# EAGLE design EtchController (EAGLE 9.4.2)
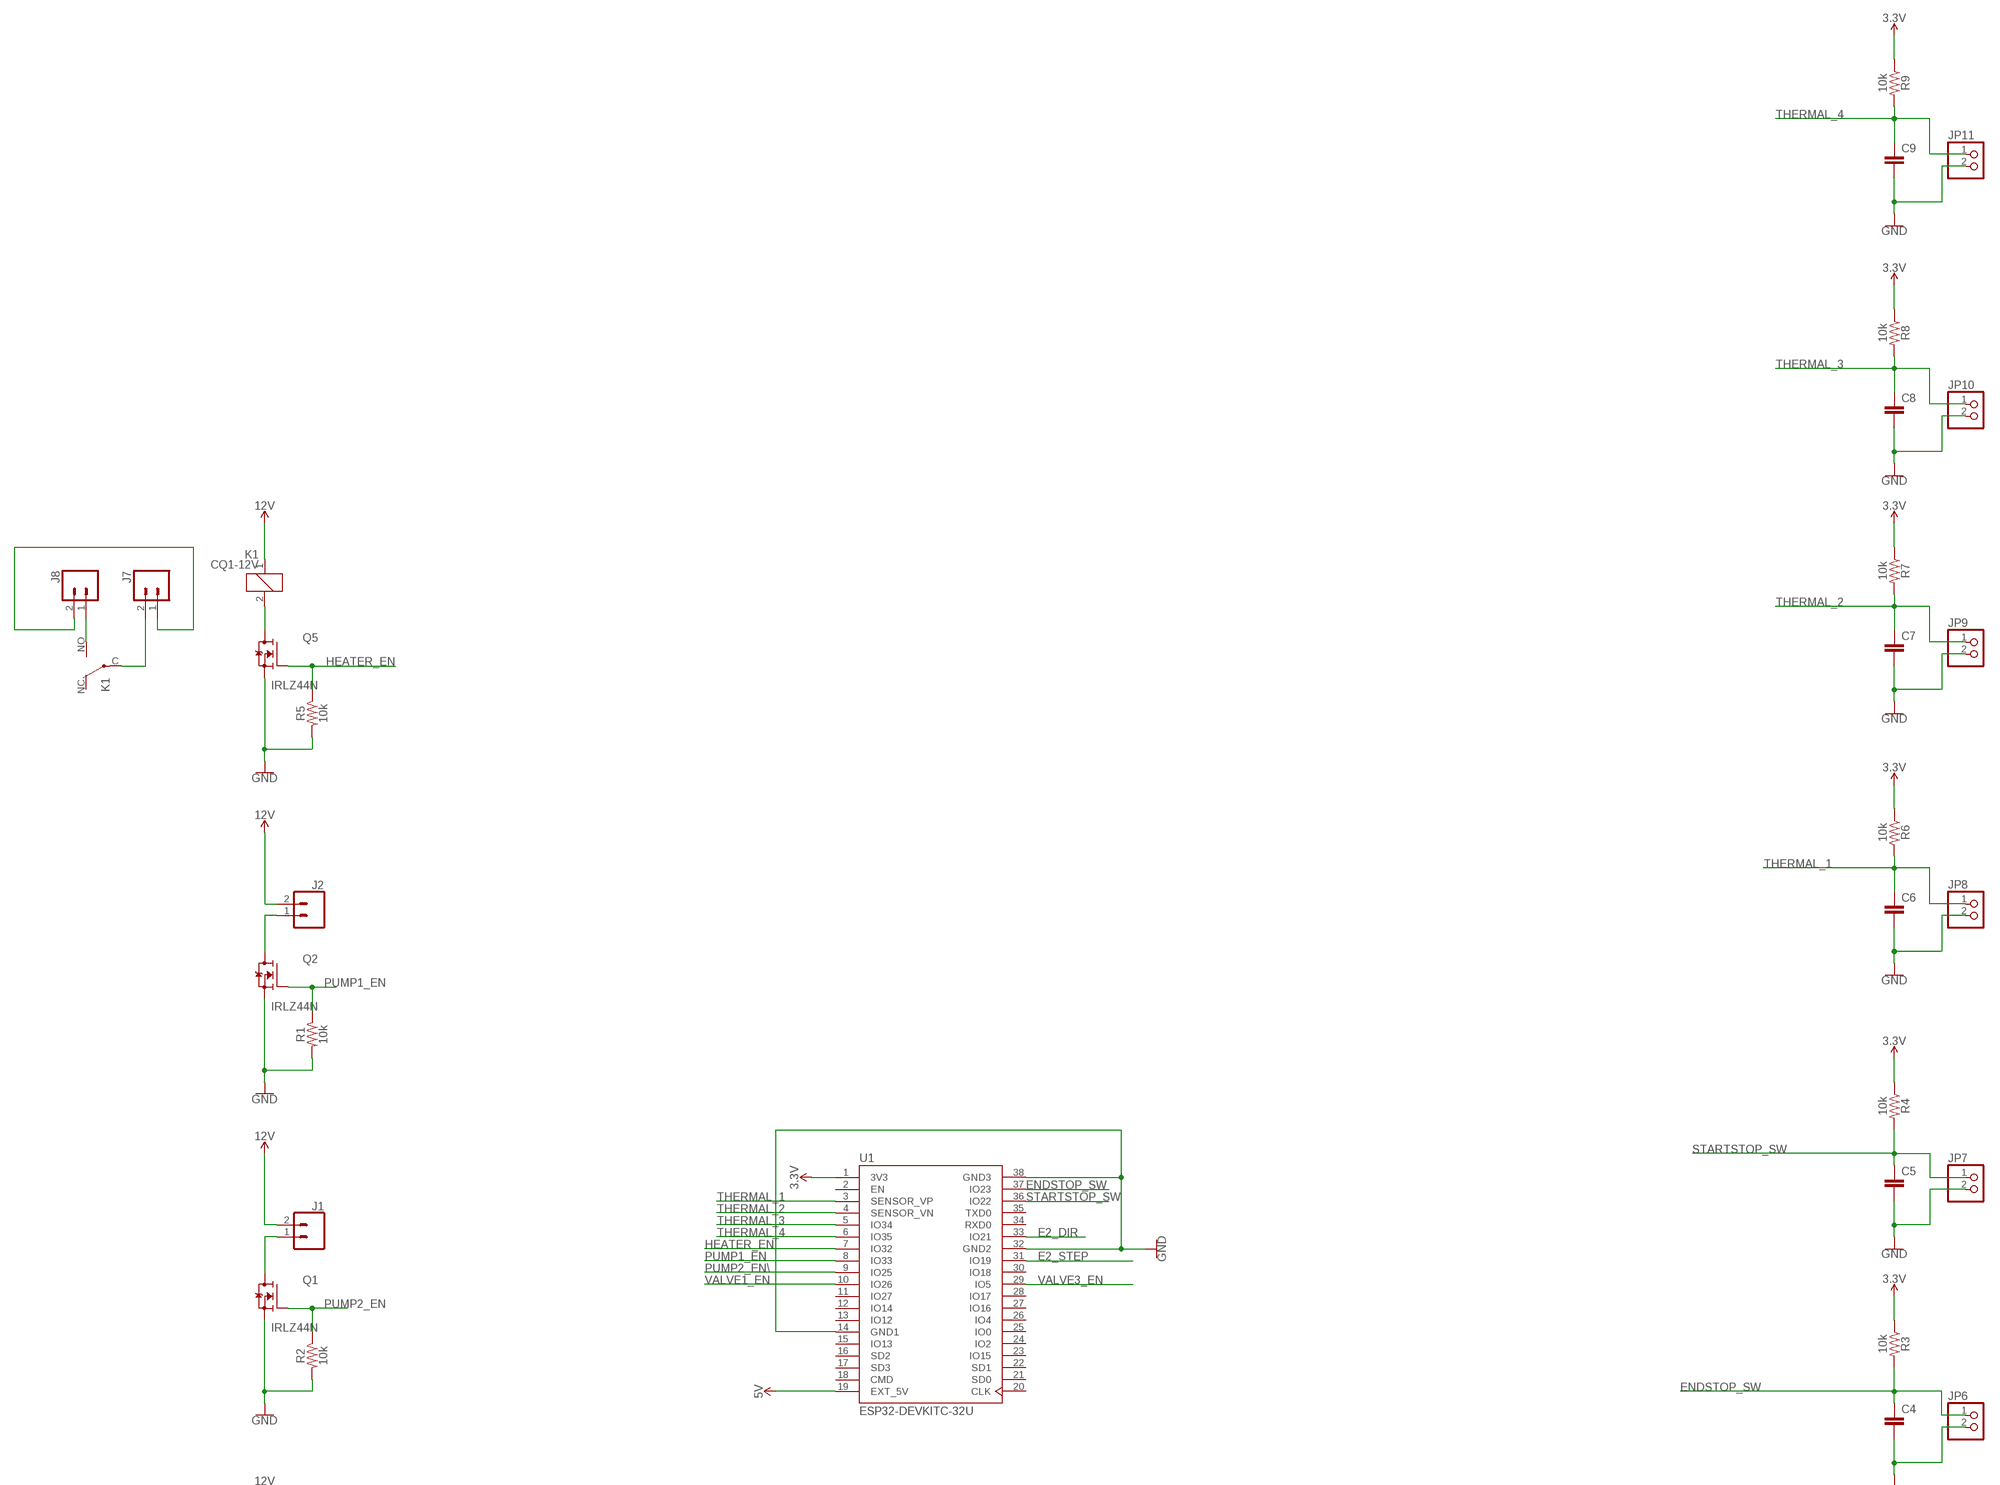
[diagram p0: schematic, sheet 1, part 1 of 2]
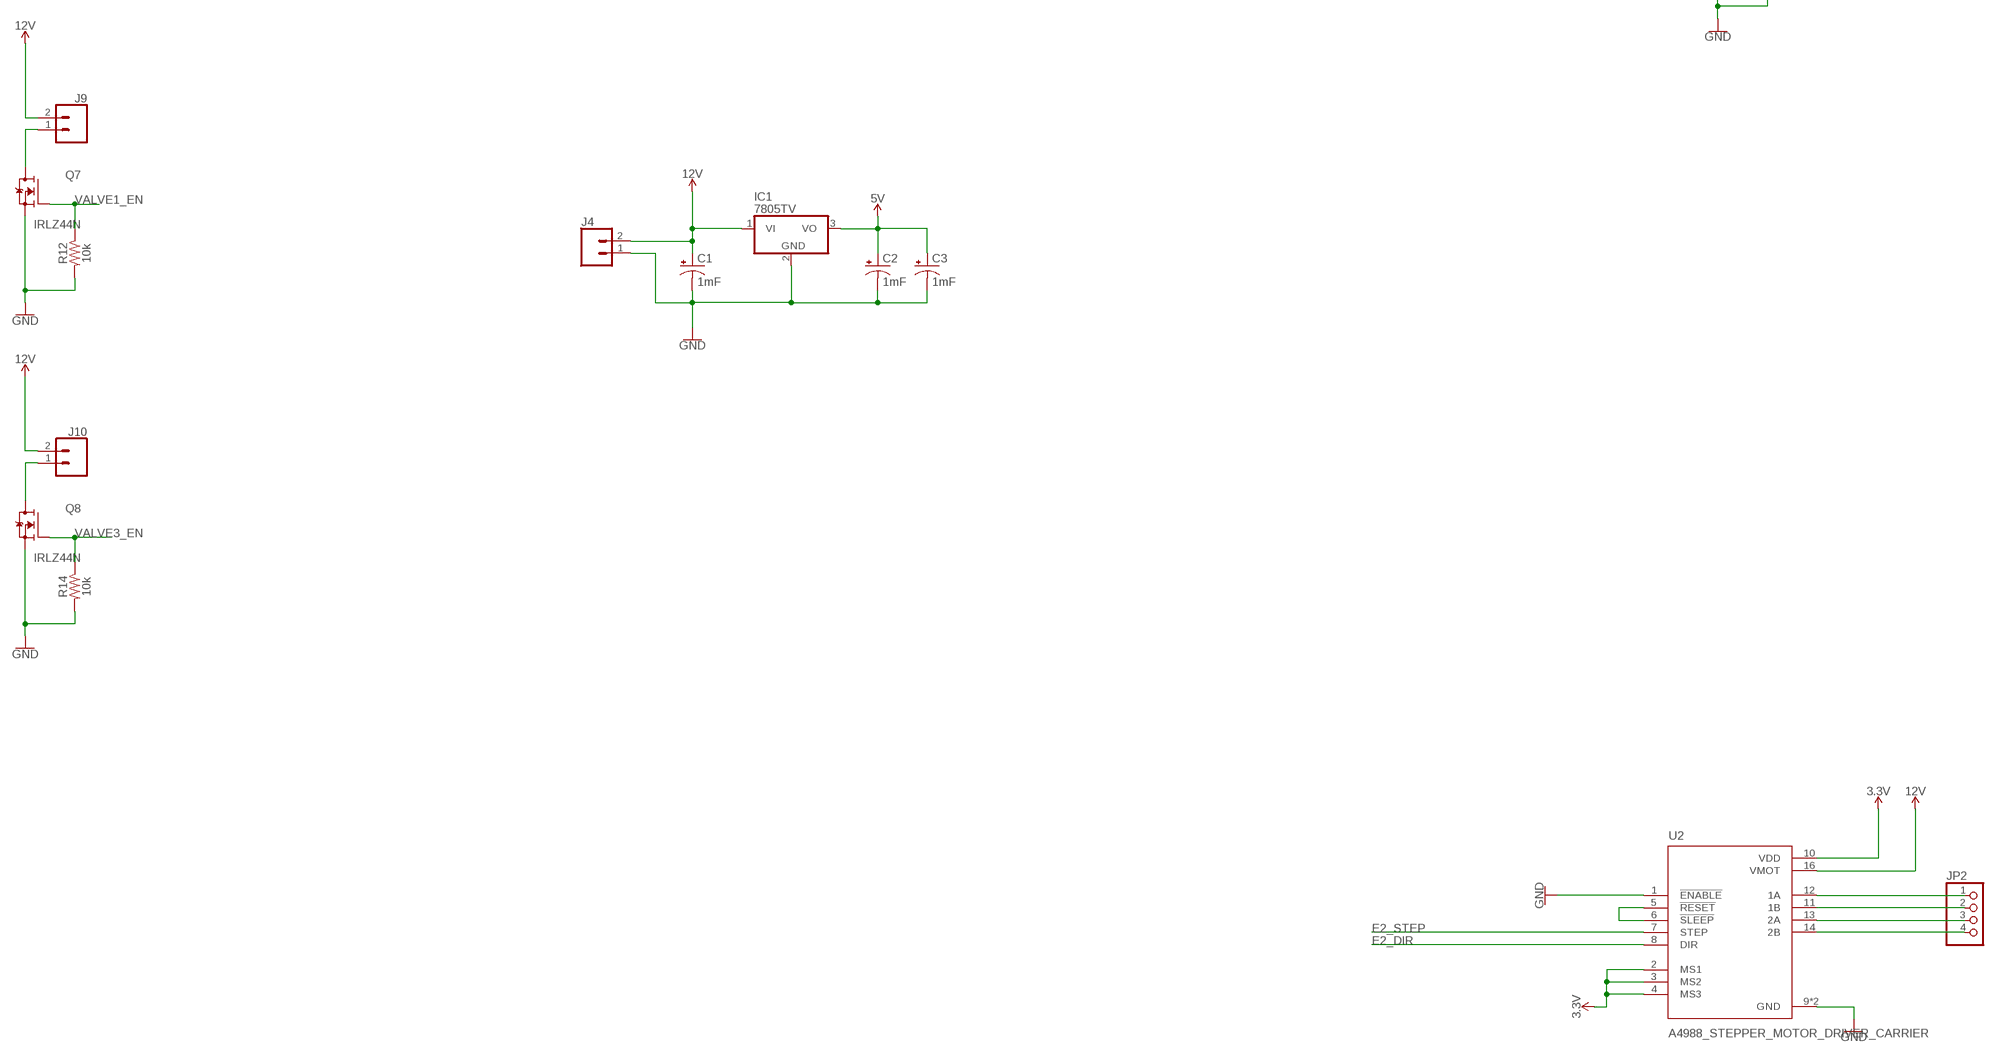
[diagram p1: schematic, sheet 1, part 2 of 2]

## Parts
C1  1mF  1000UF-RADIAL-5MM-25V-20%  [CPOL-RADIAL-5MM-10MM]
C2  1mF  1000UF-RADIAL-5MM-25V-20%  [CPOL-RADIAL-5MM-10MM]
C3  1mF  1000UF-RADIAL-5MM-25V-20%  [CPOL-RADIAL-5MM-10MM]
C4  C2,5-3  [C2.5-3]
C5  C2,5-3  [C2.5-3]
C6  C2,5-3  [C2.5-3]
C7  C2,5-3  [C2.5-3]
C8  C2,5-3  [C2.5-3]
C9  C2,5-3  [C2.5-3]
IC1  7805TV  [TO220V]
J1  CONN_023.5MM  [SCREWTERMINAL-3.5MM-2]
J2  CONN_023.5MM  [SCREWTERMINAL-3.5MM-2]
J4  CONN_023.5MM-NO_SILK  [SCREWTERMINAL-3.5MM-2-NS]
J7  CONN_025MM  [SCREWTERMINAL-5MM-2]
J8  CONN_025MM  [SCREWTERMINAL-5MM-2]
J9  CONN_023.5MM  [SCREWTERMINAL-3.5MM-2]
J10  CONN_023.5MM  [SCREWTERMINAL-3.5MM-2]
JP2  PINHD-1X4  [1X04]
JP6  PINHD-1X2  [1X02]
JP7  PINHD-1X2  [1X02]
JP8  PINHD-1X2  [1X02]
JP9  PINHD-1X2  [1X02]
JP10  PINHD-1X2  [1X02]
JP11  PINHD-1X2  [1X02]
K1  CQ1-12V  [CQ1]
Q1  IRLZ44N  [TO254P1054X469X1930-3]
Q2  IRLZ44N  [TO254P1054X469X1930-3]
Q5  IRLZ44N  [TO254P1054X469X1930-3]
Q7  IRLZ44N  [TO254P1054X469X1930-3]
Q8  IRLZ44N  [TO254P1054X469X1930-3]
R1  10k  10KOHM-VERT-1/4W-1%  [AXIAL-0.1]
R2  10k  10KOHM-VERT-1/4W-1%  [AXIAL-0.1]
R3  10k  10KOHM-VERT-1/4W-1%  [AXIAL-0.1]
R4  10k  10KOHM-VERT-1/4W-1%  [AXIAL-0.1]
R5  10k  10KOHM-VERT-1/4W-1%  [AXIAL-0.1]
R6  10k  10KOHM-VERT-1/4W-1%  [AXIAL-0.1]
R7  10k  10KOHM-VERT-1/4W-1%  [AXIAL-0.1]
R8  10k  10KOHM-VERT-1/4W-1%  [AXIAL-0.1]
R9  10k  10KOHM-VERT-1/4W-1%  [AXIAL-0.1]
R12  10k  10KOHM-VERT-1/4W-1%  [AXIAL-0.1]
R14  10k  10KOHM-VERT-1/4W-1%  [AXIAL-0.1]
U1  ESP32-DEVKITC-32U  [MODULE_ESP32-DEVKITC-32U]
U2  A4988_STEPPER_MOTOR_DRIVER_CARRIER  [MODULE_A4988_STEPPER_MOTOR_DRIVER_CARRIER]

## Nets
3.3V: R3.P$1 R4.P$1 R6.P$1 R7.P$1 R8.P$1 R9.P$1 U1.1(3V3) U2.2(MS1) U2.3(MS2) U2.4(MS3) U2.10(VDD)
5V: C2.+ C3.+ IC1.3(VO) U1.19(EXT_5V)
12V: C1.+ IC1.1(VI) J1.2 J2.2 J4.2 J9.2 J10.2 K1.1 U2.16(VMOT)
E2_DIR: U1.33(IO21) U2.8(DIR)
E2_STEP: U1.31(IO19) U2.7(STEP)
ENDSTOP_SW: C4.1 JP6.1 R3.P$2 U1.37(IO23)
GND: C1.- C2.- C3.- C4.2 C5.2 C6.2 C7.2 C8.2 C9.2 IC1.2(GND) J4.1 JP6.2 JP7.2 JP8.2 JP9.2 JP10.2 JP11.2 Q1.3(S) Q2.3(S) Q5.3(S) Q7.3(S) Q8.3(S) R1.P$2 R2.P$2 R5.P$2 R12.P$2 R14.P$2 U1.14(GND1) U1.32(GND2) U1.38(GND3) U2.1(!ENABLE) U2.9(GND) U2.15(GND)
HEATER_EN: Q5.1(G) R5.P$1 U1.7(IO32)
N$4: JP2.1 U2.12(1A)
N$6: JP2.2 U2.11(1B)
N$7: J2.1 Q2.2(D)
N$8: J1.1 Q1.2(D)
N$9 [220V]: J8.1 K1.NO(2:S)
N$10 [220V]: J7.2 K1.C(2:P)
N$12: JP2.3 U2.13(2A)
N$13: K1.2 Q5.2(D)
N$14 [220V]: J7.1 J8.2
N$15: JP2.4 U2.14(2B)
N$22: U2.5(!RESET) U2.6(!SLEEP)
N$44: J9.1 Q7.2(D)
N$48: J10.1 Q8.2(D)
PUMP1_EN: Q2.1(G) R1.P$1 U1.8(IO33)
PUMP2_EN: Q1.1(G) R2.P$1
PUMP2_EN\: U1.9(IO25)
STARTSTOP_SW: C5.1 JP7.1 R4.P$2 U1.36(IO22)
THERMAL_1: C6.1 JP8.1 R6.P$2 U1.3(SENSOR_VP)
THERMAL_2: C7.1 JP9.1 R7.P$2 U1.4(SENSOR_VN)
THERMAL_3: C8.1 JP10.1 R8.P$2 U1.5(IO34)
THERMAL_4: C9.1 JP11.1 R9.P$2 U1.6(IO35)
VALVE1_EN: Q7.1(G) R12.P$1 U1.10(IO26)
VALVE3_EN: Q8.1(G) R14.P$1 U1.29(IO5)
Unconnected: K1.NC(2:O) U1.2(EN) U1.11(IO27) U1.12(IO14) U1.13(IO12) U1.15(IO13) U1.16(SD2) U1.17(SD3) U1.18(CMD) U1.20(CLK) U1.21(SD0) U1.22(SD1) U1.23(IO15) U1.24(IO2) U1.25(IO0) U1.26(IO4) U1.27(IO16) U1.28(IO17) U1.30(IO18) U1.34(RXD0) U1.35(TXD0)

## Library data of the parts
C1-C3 = SparkFun-Capacitors:1000UF: 1,000µF/1mF ceramic capacitors A capacitor is a passive two-terminal electrical component used to store electrical energy temporarily in an electric field. CAP-08070; PROD_ID: CAP-09538
C4-C9 = capacitor-wima:C: CAPACITOR naming: grid - package width
IC1 = linear:78*: Positive VOLTAGE REGULATOR Source: http://cache.national.com/ds/LM/LM78L05.pdf http://www.fairchildsemi.com/ds/LM/LM7805.pdf
J1 J2 J4 J9 J10 = SparkFun-Connectors:CONN_02: Multi connection point. Often used as Generic Header-pin footprint for 0.1 inch spaced/style header connections On any of the 0.1 inch spaced packages, you can populate with these: Break Away Headers - Straight <https://www.sparkfun.com/products/116> (PRT-00116) Break Away Male Headers - Right Angle <https://www.sparkfun.com/products/553> (PRT-00553) Female Headers <https://www.sparkfun.com/products/115> (PRT-00115) Break Away Headers - Machine Pin <https://www.sparkfun.com/products/117> (PRT-00117) Break Away Female Headers - Swiss Machine Pin <https://www.sparkfun.com/products/743> (PRT-00743) For SCREWTERMINALS and SPRING TERMINALS visit here: Screw Terimnals on SparkFun.com <https://www.sparkfun.com/search/results?term=Screw+Terminals> (5mm/3.5mm/2.54mm spacing) This device is also useful as a general connection point to wire up your design to another part of your project. Our various solder wires solder well into these plated through hole pads. Hook-Up Wire - Assortment (Stranded, 22 AWG) <https://www.sparkfun.com/products/11375> (PRT-11375) Hook-Up Wire - Assortment (Solid Core, 22 AWG) <https://www.sparkfun.com/products/11367> (PRT-11367) View the entire wire category on our website here <https://www.sparkfun.com/categories/141> Special notes: Molex polarized connector foot print use with: PRT-08233 with associated crimp pins and housings. 2.54_SCREWTERM for use with PRT-10571. 3.5mm Screw Terminal footprints for PRT-08084 5mm Screw Terminal footprints for use with PRT-08432; PROD_ID: CONN-08399
J7 J8 = SparkFun-Connectors:CONN_02: Multi connection point. Often used as Generic Header-pin footprint for 0.1 inch spaced/style header connections On any of the 0.1 inch spaced packages, you can populate with these: Break Away Headers - Straight <https://www.sparkfun.com/products/116> (PRT-00116) Break Away Male Headers - Right Angle <https://www.sparkfun.com/products/553> (PRT-00553) Female Headers <https://www.sparkfun.com/products/115> (PRT-00115) Break Away Headers - Machine Pin <https://www.sparkfun.com/products/117> (PRT-00117) Break Away Female Headers - Swiss Machine Pin <https://www.sparkfun.com/products/743> (PRT-00743) For SCREWTERMINALS and SPRING TERMINALS visit here: Screw Terimnals on SparkFun.com <https://www.sparkfun.com/search/results?term=Screw+Terminals> (5mm/3.5mm/2.54mm spacing) This device is also useful as a general connection point to wire up your design to another part of your project. Our various solder wires solder well into these plated through hole pads. Hook-Up Wire - Assortment (Stranded, 22 AWG) <https://www.sparkfun.com/products/11375> (PRT-11375) Hook-Up Wire - Assortment (Solid Core, 22 AWG) <https://www.sparkfun.com/products/11367> (PRT-11367) View the entire wire category on our website here <https://www.sparkfun.com/categories/141> Special notes: Molex polarized connector foot print use with: PRT-08233 with associated crimp pins and housings. 2.54_SCREWTERM for use with PRT-10571. 3.5mm Screw Terminal footprints for PRT-08084 5mm Screw Terminal footprints for use with PRT-08432; SF_SKU: PRT-08432
JP2 = pinhead:PINHD-1X4: PIN HEADER
JP6-JP11 = pinhead:PINHD-1X2: PIN HEADER
K1 = relay:CQ1-12V: AUTOMOTIVE QUIET RELAY NAiS Source: http://www.mew-europe.com/.. en_ds_61208_0000.pdf; OC_FARNELL: unknown; OC_NEWARK: unknown
Q1 Q2 Q5 Q7 Q8 = IRLZ44N:IRLZ44N: 55V Single N-Channel HEXFET Power MOSFET in a TO-220AB package Check availability <https://pricing.snapeda.com/parts/IRLZ44N/Infineon%20/%20IR/view-part?ref=eda>; AVAILABILITY: In Stock; DESCRIPTION: N-Channel 55 V 47A (Tc) 3.8W (Ta), 110W (Tc) Surface Mount D2PAK; MF: Infineon / IR; MP: IRLZ44N; PACKAGE: TO-220-3 Infineon / IR; PRICE: None; PURCHASE-URL: https://pricing.snapeda.com/search/part/IRLZ44N/?ref=eda
R1-R9 R12 R14 = SparkFun-Resistors:10KOHM: 10kΩ resistor A resistor is a passive two-terminal electrical component that implements electrical resistance as a circuit element. Resistors act to reduce current flow, and, at the same time, act to lower voltage levels within circuits. - Wikipedia; PROD_ID: RES-12183
U1 = ESP32-DEVKITC-32U:ESP32-DEVKITC-32U: ESP32-DEVKITC Check availability <https://pricing.snapeda.com/parts/ESP32-DEVKITC-32U/Espressif%20Systems/view-part?ref=eda>; AVAILABILITY: In Stock; CHECK_PRICES: https://www.snapeda.com/parts/ESP32-DEVKITC-32U/Espressif+Systems/view-part/?ref=eda; DESCRIPTION: ESP32-WROOM-32UE series Transceiver; 802.11 b/g/n (Wi-Fi, WiFi, WLAN), Bluetooth® Smart Ready 4.x Dual Mode Evaluation Board; MF: Espressif Systems; MP: ESP32-DEVKITC-32U; PACKAGE: CUSTOM-38 ESPRESSIF; PRICE: None; PURCHASE-URL: https://www.snapeda.com/api/url_track_click_mouser/?unipart_id=2781909&manufacturer=Espressif Systems&part_name=ESP32-DEVKITC-32U&search_term=esp32-devkitc-32u; SNAPEDA_LINK: https://www.snapeda.com/parts/ESP32-DEVKITC-32U/Espressif+Systems/view-part/?ref=snap
U2 = A4988_STEPPER_MOTOR_DRIVER_CARRIER:A4988_STEPPER_MOTOR_DRIVER_CARRIER: Stepper motor controler; IC: A4988; 1A; Uin mot: 8÷35V Check availability <https://pricing.snapeda.com/parts/A4988%20STEPPER%20MOTOR%20DRIVER%20CARRIER/Pololu/view-part?ref=eda>; AVAILABILITY: Not in stock; CHECK_PRICES: https://www.snapeda.com/parts/A4988%20STEPPER%20MOTOR%20DRIVER%20CARRIER/Pololu/view-part/?ref=eda; DESCRIPTION: Stepper Motor Driver; MF: Pololu; MP: A4988 STEPPER MOTOR DRIVER CARRIER; PACKAGE: None; PRICE: None; SNAPEDA_LINK: https://www.snapeda.com/parts/A4988%20STEPPER%20MOTOR%20DRIVER%20CARRIER/Pololu/view-part/?ref=snap

## Net classes
0 default: width 0.762 mm, clearance 0.356 mm
1 220V: width 1.27 mm, clearance 1.27 mm

## Board
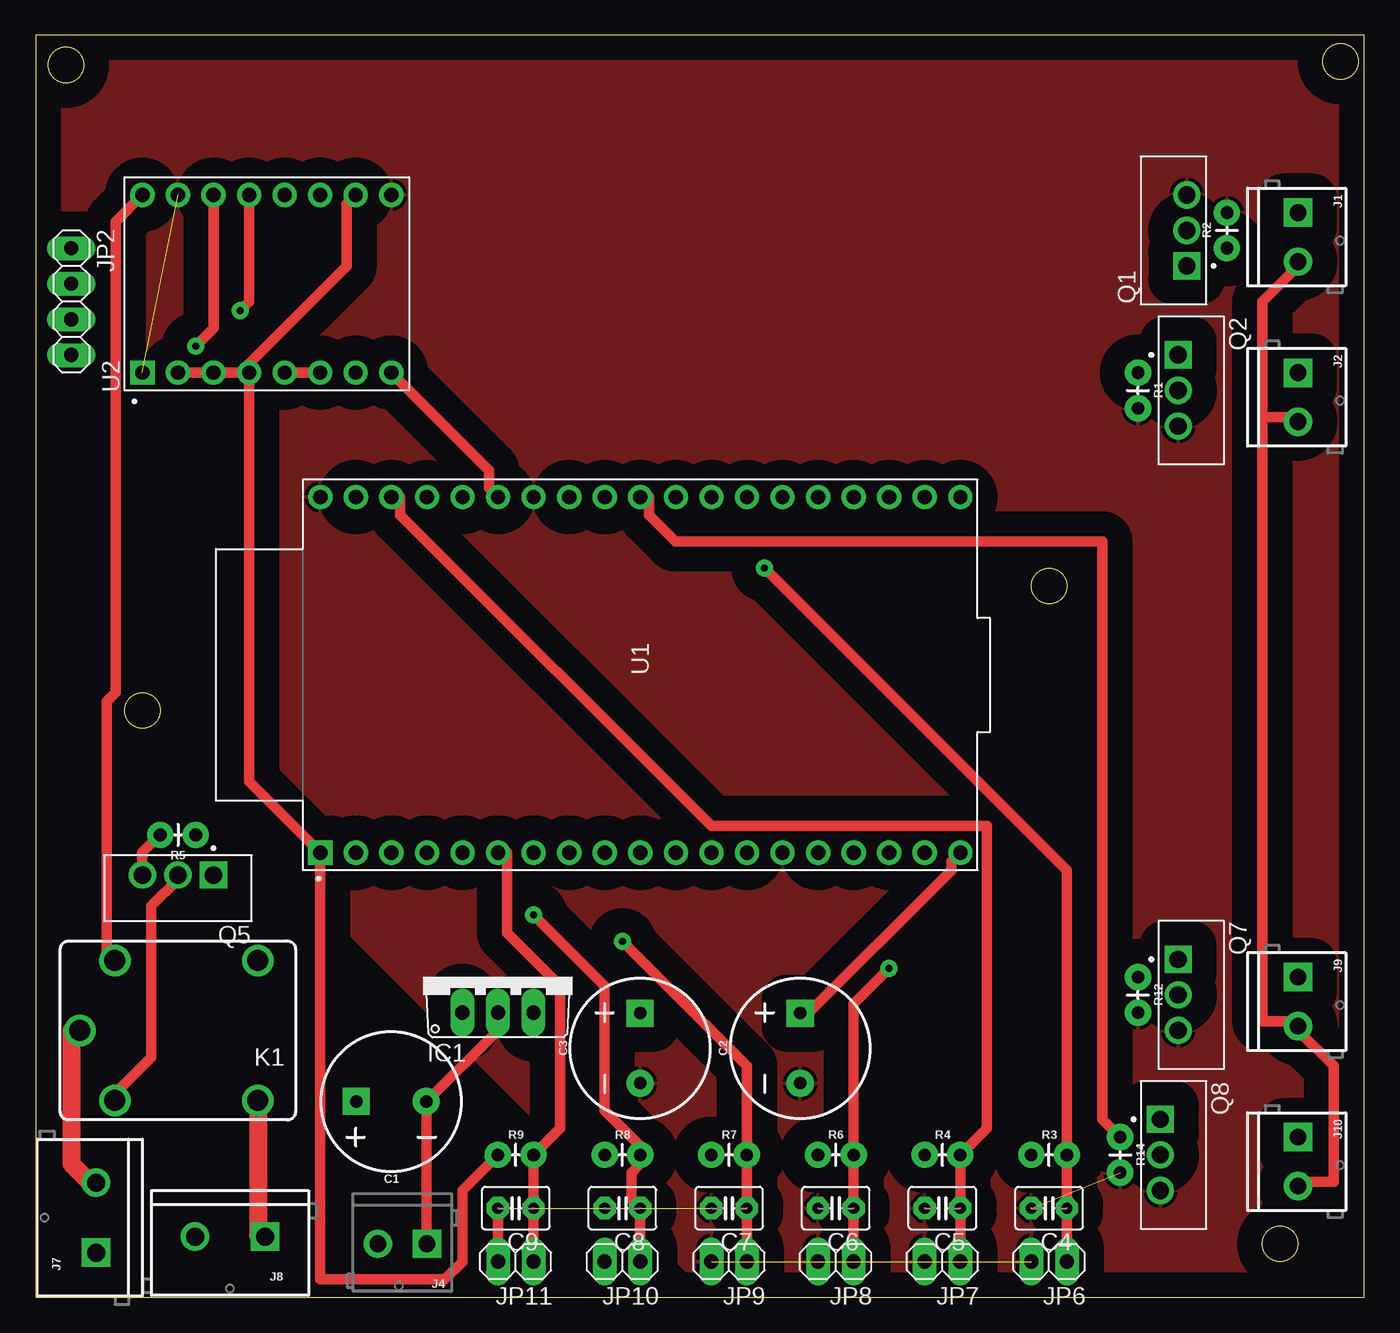
[diagram p2: board, top side]
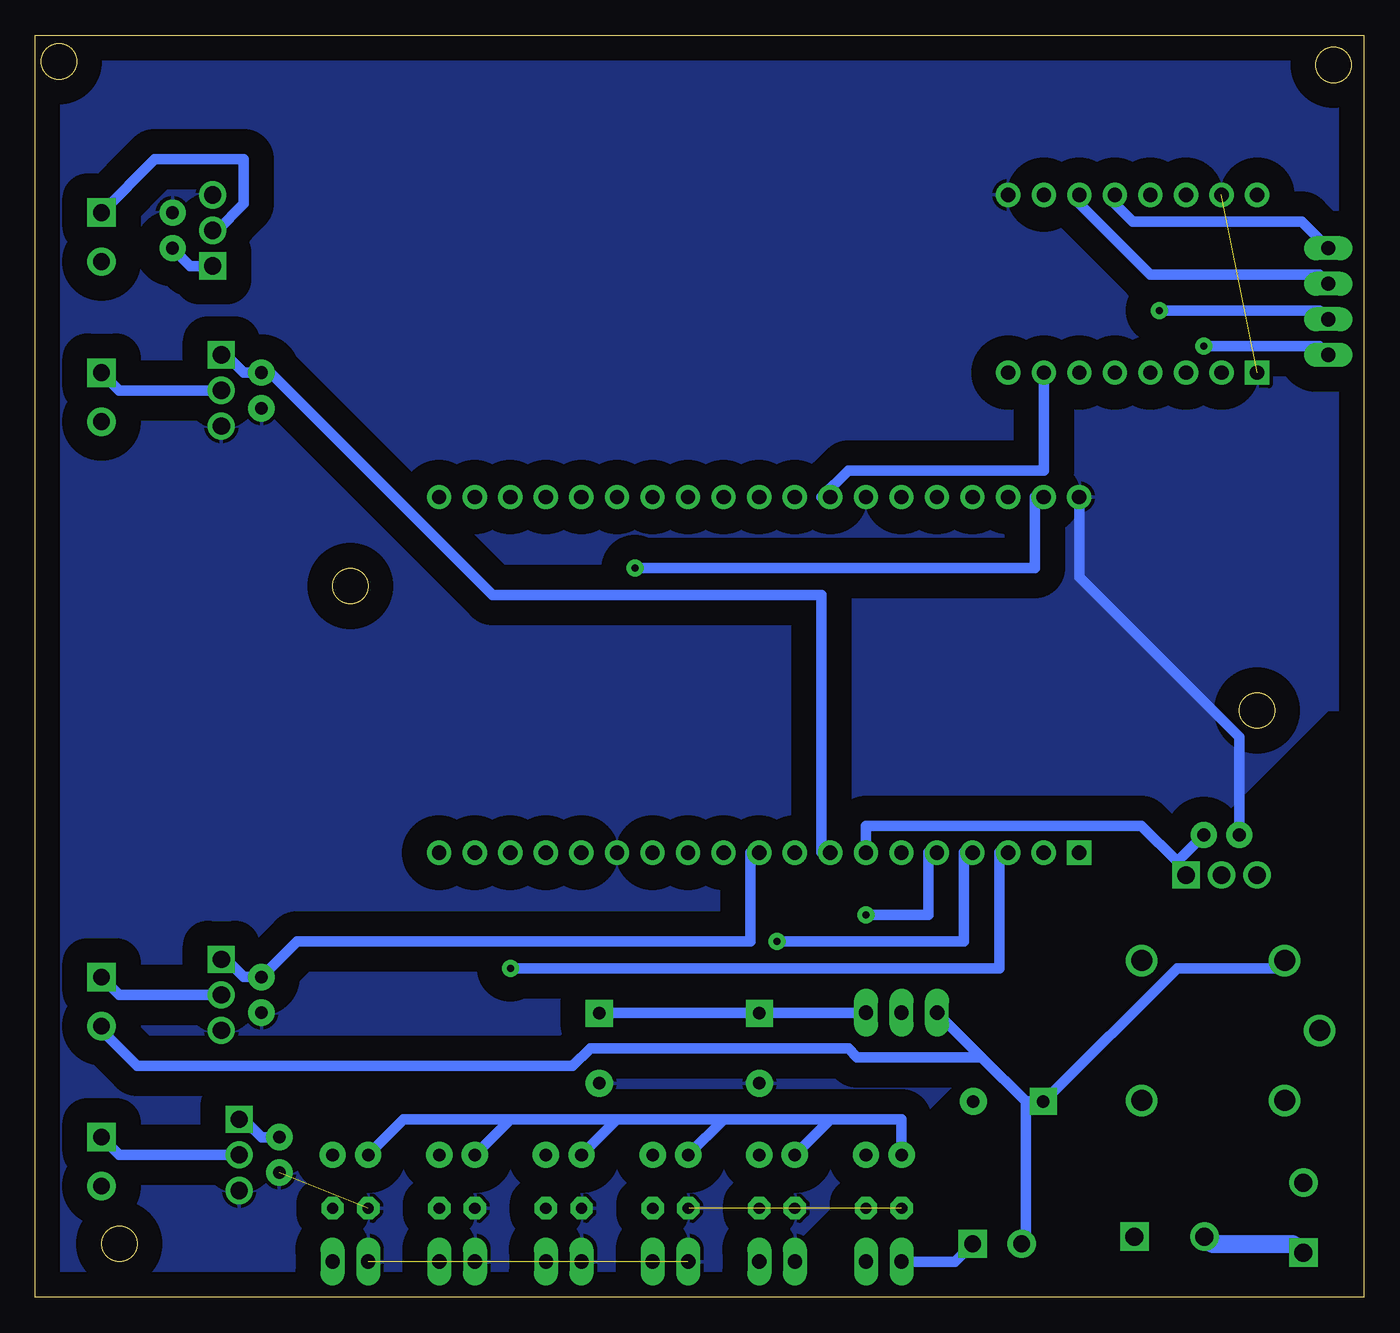
[diagram p3: board, bottom side, seen from below]

Size 94.92 x 90.16 mm. Coordinates in mm from the lower left corner, seen from the top.
Outline: 0,0 94.92,0 94.92,90.16 0,90.16 0,0
Outline: circle at 2.16,88.01 radius 1.27
Outline: circle at 93.22,88.27 radius 1.27
Outline: circle at 72.39,50.8 radius 1.27
Outline: circle at 7.62,41.91 radius 1.27
Outline: circle at 88.9,3.81 radius 1.27
Copper layers (1*16): Top 0.035mm / dielectric 1.5mm / Bottom 0.035mm
Design rules "default *": minimum track width 24mil, minimum drill 0.5mm, track to track 24mil, track to pad 24mil, pad to pad 24mil, via to via 24mil, smd to smd 24mil, copper to edge 20mil, drill to drill 20mil, minimum pad ring 14mil, minimum via ring 14mil, stop-mask expansion 14mil, vias tented up to drill 0mil, thermal gap 10mil

### Footprints (pad centres in the part's own frame; a part is rotated, then mirrored left to right if it is on the bottom)
CPOL-RADIAL-5MM-10MM = drill 0.9 pad 1.93 square: + 2.5,0 | drill 0.9 pad 1.93: - -2.5,0
C2.5-3 = drill 0.813 pad 1.6 octagon: 1 -1.27,0; 2 1.27,0
TO220V = drill 1.016 long: 1 -2.54,-2.54; 2 0,-2.54; 3 2.54,-2.54
SCREWTERMINAL-3.5MM-2 = drill 1.2 pad 2.032 square: 1 0,0 | drill 1.2 pad 2.032: 2 3.5,0
SCREWTERMINAL-3.5MM-2-NS = drill 1.2 pad 2.032 square: 1 0,0 | drill 1.2 pad 2.032: 2 3.5,0
SCREWTERMINAL-5MM-2 = drill 1.3 pad 2.032 square: 1 0,0 | drill 1.3 pad 2.032: 2 5,0
1X04 = drill 1.016 long: 1 -3.81,0; 2 -1.27,0; 3 1.27,0; 4 3.81,0
1X02 = drill 1.016 long: 1 -1.27,0; 2 1.27,0
CQ1 = drill 1.5: 1 4.5,-5; 2 4.5,5; C 7,0; NC -5.7,-5; NO -5.7,5
TO254P1054X469X1930-3 = drill 1.23 pad 1.85 square: 1 -2.54,-0.94 | drill 1.23 pad 1.85: 2 0,-0.94; 3 2.54,-0.94
AXIAL-0.1 = drill 0.9 pad 1.88: P$1 -1.27,0; P$2 1.27,0
MODULE_ESP32-DEVKITC-32U = drill 1.02 square: 1 -12.7,22.85 | drill 1.02: 2 -12.7,20.31; 3 -12.7,17.77; 4 -12.7,15.23; 5 -12.7,12.69; 6 -12.7,10.15; 7 -12.7,7.61; 8 -12.7,5.07; 9 -12.7,2.53; 10 -12.7,-0.01; 11 -12.7,-2.55; 12 -12.7,-5.09; 13 -12.7,-7.63; 14 -12.7,-10.17; 15 -12.7,-12.71; 16 -12.7,-15.25; 17 -12.7,-17.79; 18 -12.7,-20.33; 19 -12.7,-22.87; 20 12.7,-22.87; 21 12.7,-20.33; 22 12.7,-17.79; 23 12.7,-15.25; 24 12.7,-12.71; 25 12.7,-10.17; 26 12.7,-7.63; 27 12.7,-5.09; 28 12.7,-2.55; 29 12.7,-0.01; 30 12.7,2.53; 31 12.7,5.07; 32 12.7,7.61; 33 12.7,10.15; 34 12.7,12.69; 35 12.7,15.23; 36 12.7,17.77; 37 12.7,20.31; 38 12.7,22.85
MODULE_A4988_STEPPER_MOTOR_DRIVER_CARRIER = drill 1.02 square: 1 -6.35,8.89 | drill 1.02: 2 -6.35,6.35; 3 -6.35,3.81; 4 -6.35,1.27; 5 -6.35,-1.27; 6 -6.35,-3.81; 7 -6.35,-6.35; 8 -6.35,-8.89; 9 6.35,-8.89; 10 6.35,-6.35; 11 6.35,-3.81; 12 6.35,-1.27; 13 6.35,1.27; 14 6.35,3.81; 15 6.35,6.35; 16 6.35,8.89

### Placement (x,y rotation side)
C1  25.4,13.97 180 top
C2  54.61,17.78 90 top
C3  43.18,17.78 90 top
C4  72.39,6.35 180 top
C5  64.77,6.35 180 top
C6  57.15,6.35 180 top
C7  49.53,6.35 180 top
C8  41.91,6.35 180 top
C9  34.29,6.35 180 top
IC1  33.02,22.86 0 top
J1  90.17,77.47 270 top
J2  90.17,66.04 270 top
J4  27.94,3.81 180 top
J7  4.32,3.18 90 top
J8  16.38,4.32 180 top
J9  90.17,22.86 270 top
J10  90.17,11.43 270 top
JP2  2.54,71.12 270 top
JP6  72.39,2.54 180 top
JP7  64.77,2.54 180 top
JP8  57.15,2.54 180 top
JP9  49.53,2.54 180 top
JP10  41.91,2.54 180 top
JP11  34.29,2.54 180 top
K1  10.16,19.05 180 top
Q1  81.28,76.2 90 top
Q2  82.55,64.77 270 top
Q5  10.16,29.21 180 top
Q7  82.55,21.59 270 top
Q8  81.28,10.16 270 top
R1  78.74,64.77 270 top
R2  85.09,76.2 90 top
R3  72.39,10.16 0 top
R4  64.77,10.16 0 top
R5  10.16,33.02 180 top
R6  57.15,10.16 0 top
R7  49.53,10.16 0 top
R8  41.91,10.16 0 top
R9  34.29,10.16 0 top
R12  78.74,21.59 270 top
R14  77.47,10.16 270 top
U1  43.18,44.45 90 top
U2  16.51,72.39 90 top

### Tracks (layer width: path | path; a pad name or v marks a point on that pad's centre or on a via)
3.3V
  Top 0.762: U2.2 U2.3 U2.4 | U1.1 15.24,36.83 U2.4 | U2.10 22.23,78.11 22.23,73.66 15.24,66.67 U2.4 | R9.P$1 30.48,7.62 30.48,2.54 29.21,1.27 20.32,1.27 U1.1 | U1.1
  Bottom 0.762: R9.P$1 33.02,12.7 38.1,12.7 | R8.P$1 38.1,12.7 | 45.72,12.7 R7.P$1 | 38.1,12.7 45.72,12.7 | 53.34,12.7 R6.P$1 | 45.72,12.7 53.34,12.7 | 60.96,12.7 R4.P$1 | 53.34,12.7 60.96,12.7 | R3.P$1 68.58,12.7 60.96,12.7
5V
  Top 0.762: U1.19 65.41,31.12 65.41,30.48 54.61,19.69 C2.+
  Bottom 0.762: 43.18,20.32 IC1.3 | 43.18,20.32 54.61,20.32 C2.+ | 43.18,20.32 C3.+
12V
  Top 0.762: J10.2 90.17,8.26 92.71,8.26 92.71,16.51 90.17,19.05 J9.2 90.17,19.69 87.63,19.69 87.63,62.86 | 87.63,62.86 90.17,62.86 J2.2 | 87.63,62.86 87.63,71.12 90.17,73.66 J1.2 | U2.16 5.71,76.84 5.71,43.18 5.08,42.55 5.08,24.13 K1.1
  Bottom 0.762: 24.13,13.97 27.3,17.15 | 27.3,17.15 IC1.1 | 24.13,13.97 C1.+ 22.86,13.97 13.34,23.5 5.71,23.5 K1.1 | 24.13,13.97 24.13,3.81 J4.2 | 27.3,17.15 36.2,17.15 36.83,17.78 55.24,17.78 56.52,16.51 87.63,16.51 90.17,19.05 J9.2
E2_DIR
  Top 0.762: U2.8 32.38,59.06 32.38,57.78 U1.33
E2_STEP
  Bottom 0.762: U2.7 22.86,59.06 36.83,59.06 38.73,57.15 U1.31
ENDSTOP_SW  (via drill 0.5)
  Top 0.762: JP6.1 C4.1 R3.P$2 73.66,30.48 v52.07,52.07
  Bottom 0.762: v52.07,52.07 23.5,52.07 23.5,57.15 U1.37
GND  (7 unrouted)
  Top 0.762: JP11.2 C9.2 | R5.P$2 7.62,31.75 Q5.3 | 27.94,13.97 33.02,19.05 IC1.2 | 27.94,13.97 J4.1 | 27.94,13.97 C1.- | C7.2 48.21,6.36
  Bottom 0.762: J4.1 29.21,2.54 JP11.2 | R5.P$2 8.89,40.01 20.32,51.44 U1.38
  pour Top (isolate 1.778): 0,90.17 0,48.26 48.26,0 90.17,0 93.98,3.81 93.98,85.09 90.17,88.9 88.9,90.17
  pour Bottom (isolate 1.778): 0,90.17 88.9,90.17 95.25,83.82 95.25,2.54 92.71,0 44.45,0 2.54,41.91 0,41.91
HEATER_EN
  Bottom 0.762: 13.34,31.12 12.7,30.48 Q5.1 13.34,31.12 | 13.34,31.12 15.88,33.66 35.56,33.66 U1.7 | 13.34,31.12 R5.P$1
N$4
  Bottom 0.762: JP2.1 4.45,76.84 16.51,76.84 17.78,78.11 U2.12
N$6
  Bottom 0.762: JP2.2 3.17,73.03 15.24,73.03 20.32,78.11 U2.11
N$7
  Bottom 0.762: Q2.2 88.9,64.77 J2.1
N$8
  Bottom 0.762: J1.1 86.36,81.28 80.01,81.28 80.01,78.11 81.92,76.2 Q1.2
N$9
  Top 1.27: J8.1 15.88,4.45 15.88,13.97 K1.NO
N$10
  Top 1.27: J7.2 3.81,8.26 2.54,9.53 2.54,19.05 K1.C
N$12  (via drill 0.5)
  Top 0.762: v14.61,70.48 15.24,71.12 U2.13
  Bottom 0.762: JP2.3 3.17,70.48 v14.61,70.48
N$13
  Top 0.762: Q5.2 10.16,29.85 8.26,27.94 8.26,17.15 5.71,14.61 K1.2
N$14
  Bottom 1.27: J7.1 4.45,3.18 5.08,3.81 10.79,3.81 J8.2
N$15  (via drill 0.5)
  Top 0.762: v11.43,67.95 12.7,69.22 U2.14
  Bottom 0.762: JP2.4 3.17,67.95 v11.43,67.95
N$22
  Top 0.762: U2.6 U2.5
N$44
  Bottom 0.762: Q7.2 88.9,21.59 J9.1
N$48
  Bottom 0.762: Q8.2 88.9,10.16 J10.1
PUMP1_EN
  Bottom 0.762: U1.8 38.73,31.75 38.73,50.17 62.23,50.17 78.11,66.04 R1.P$1 80.01,66.04 81.28,67.31 Q2.1
PUMP2_EN
  Bottom 0.762: R2.P$1 83.82,73.66 Q1.1
STARTSTOP_SW
  Top 0.762: JP7.1 C5.1 R4.P$2 67.94,12.07 67.94,33.66 48.26,33.66 26.04,55.88 26.04,57.15 U1.36
THERMAL_1  (via drill 0.5)
  Top 0.762: JP8.1 C6.1 R6.P$2 58.42,20.96 v60.96,23.5
  Bottom 0.762: v60.96,23.5 26.04,23.5 26.04,31.75 U1.3
THERMAL_2  (via drill 0.5)
  Top 0.762: JP9.1 C7.1 R7.P$2 50.8,16.51 v41.91,25.4
  Bottom 0.762: v41.91,25.4 28.57,25.4 28.57,31.75 U1.4
THERMAL_3  (via drill 0.5)
  Top 0.762: JP10.1 C8.1 42.55,6.99 42.55,8.89 43.18,9.53 R8.P$2 43.18,10.8 40.64,13.34 40.64,22.23 v35.56,27.3
  Bottom 0.762: v35.56,27.3 31.11,27.3 31.11,31.75 U1.5
THERMAL_4
  Top 0.762: JP11.1 C9.1 R9.P$2 37.47,12.07 37.47,22.23 33.66,26.04 33.66,31.75 U1.6
VALVE1_EN
  Bottom 0.762: U1.10 43.81,31.75 43.81,25.4 76.2,25.4 R12.P$1 80.01,22.86 81.28,24.13 Q7.1
VALVE3_EN
  Top 0.762: R14.P$1 76.2,12.7 76.2,53.98 45.72,53.98 43.81,55.88 43.81,57.15 U1.29
  Bottom 0.762: R14.P$1 78.74,11.43 80.01,12.7 Q8.1